# EAGLE design Impalyzer (EAGLE 7.6.0)
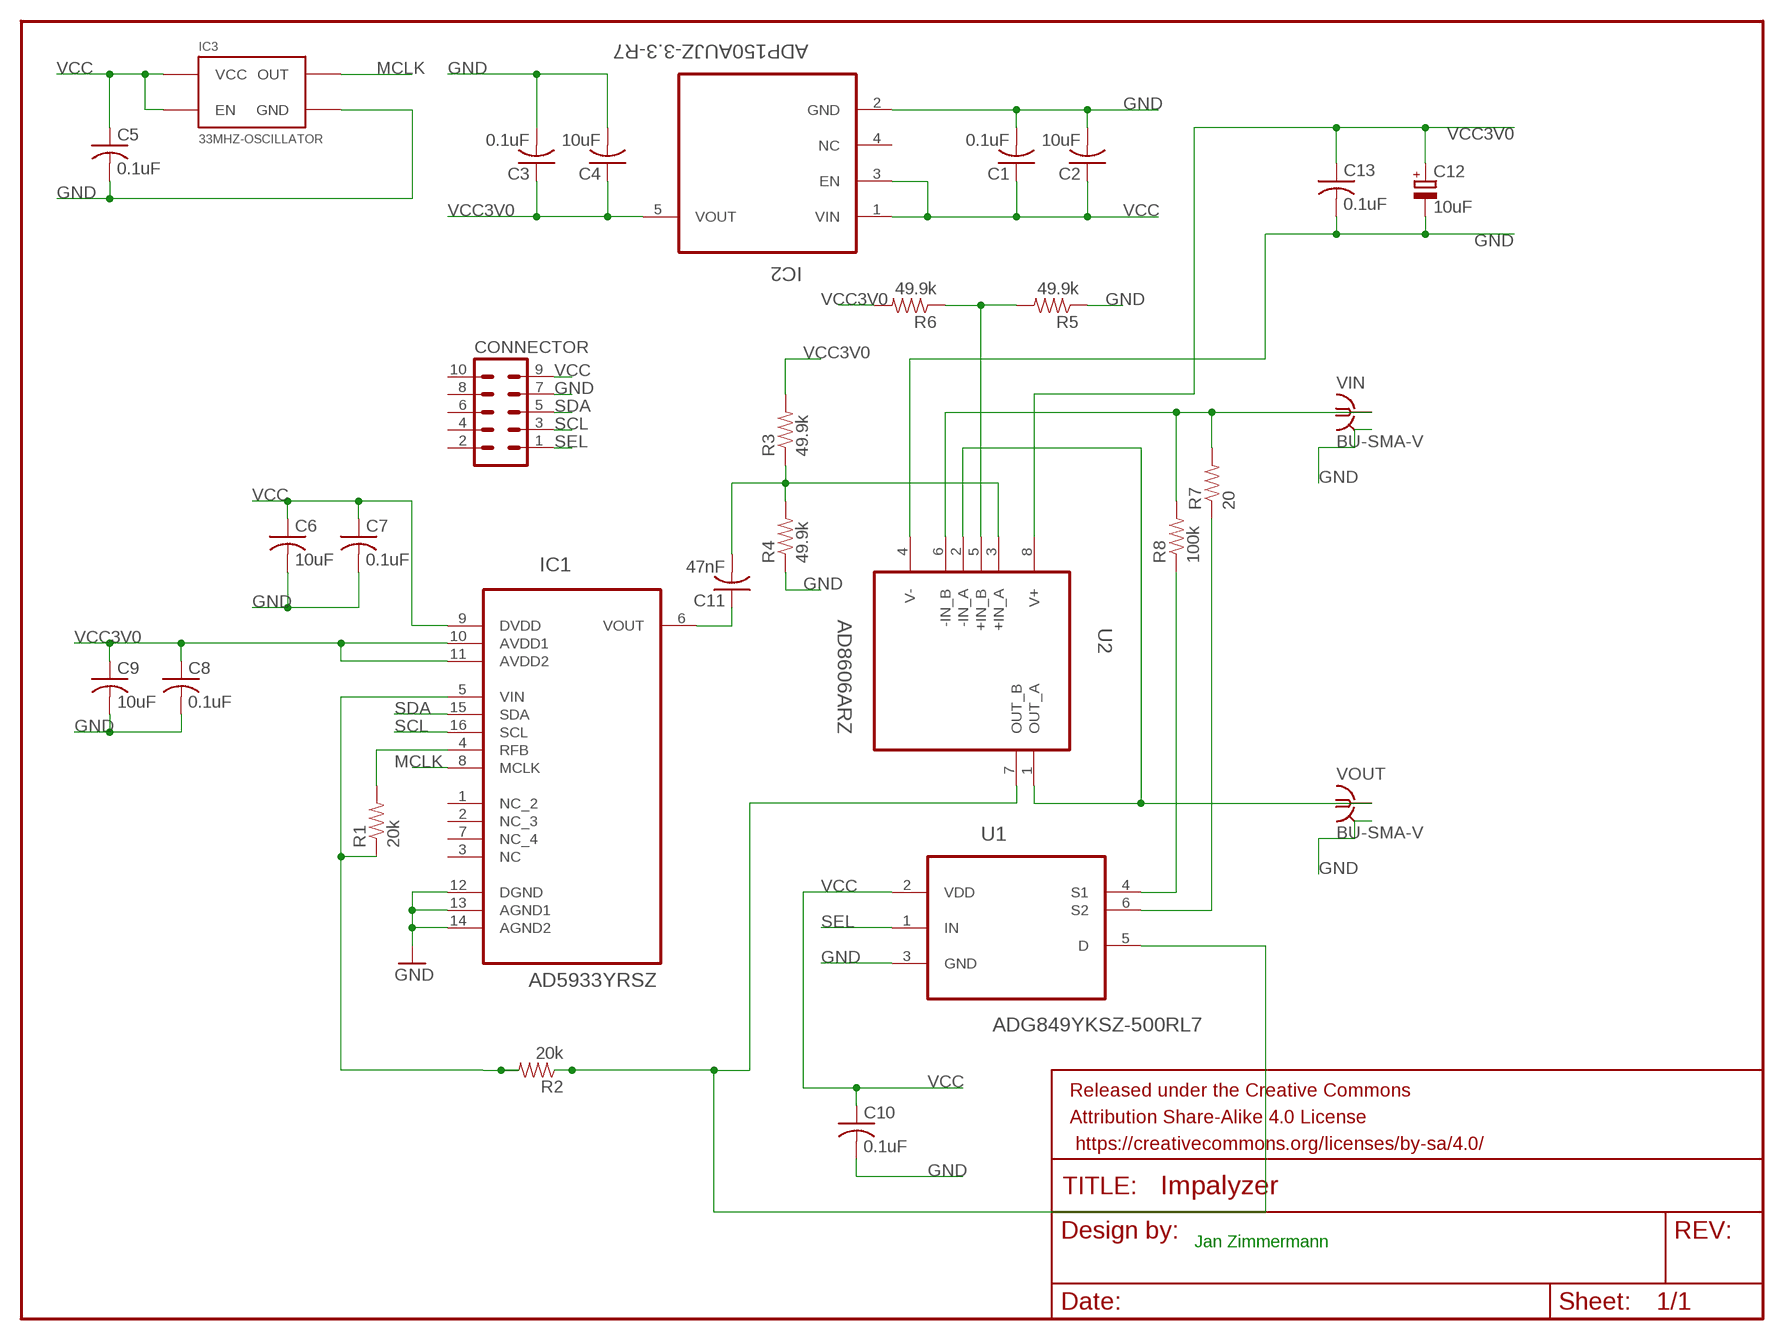
[diagram p0: schematic, sheet 1]

## Parts
C1  0.1uF  C-USC0402  [C0402]
C2  10uF  C-USC0402  [C0402]
C3  0.1uF  C-USC0402  [C0402]
C4  10uF  C-USC0402  [C0402]
C5  0.1uF  C-USC0402  [C0402]
C6  10uF  C-USC0402  [C0402]
C7  0.1uF  C-USC0402  [C0402]
C8  0.1uF  C-USC0402  [C0402]
C9  10uF  C-USC0402  [C0402]
C10  0.1uF  C-USC0402  [C0402]
C11  47nF  C-USC0402  [C0402]
C12  10uF  CPOL-EUA/3216-18W  [A/3216-18W]
C13  0.1uF  C-USC0402  [C0402]
CONNECTOR  MA05-2  [MA05-2]
FRAME1  FRAME-LETTERNO_PACKAGE  [DUMMY]
IC1  AD5933YRSZ  [SOP65P640X120-16N]
IC2  ADP150AUJZ-3.3-R7  [SOT95P280X100-5N]
IC3  33MHZ-OSCILLATOR  [CRYSTAL-OSC-SMD-5X3.2]
R1  20k  RESISTOR0603  [0603-RES]
R2  20k  RESISTOR0603  [0603-RES]
R3  49.9k  RESISTOR0603  [0603-RES]
R4  49.9k  RESISTOR0603  [0603-RES]
R5  49.9k  RESISTOR0603  [0603-RES]
R6  49.9k  RESISTOR0603  [0603-RES]
R7  20  RESISTOR2010  [R2010]
R8  100k  RESISTOR0603  [0603-RES]
U1  ADG849YKSZ-500RL7  [SOT65P210X110-6N]
U2  AD8606ARZ  [SOIC127P600X175-8N]
VIN  BU-SMA-V  [BU-SMA-V]
VOUT  BU-SMA-V  [BU-SMA-V]

## Nets
GND: C1.2 C2.2 C3.2 C4.2 C5.2 C6.2 C7.2 C8.2 C9.2 C10.2 C12.- C13.2 CONNECTOR.7 IC1.12(DGND) IC1.13(AGND1) IC1.14(AGND2) IC2.2(GND) IC3.2(GND) R4.1 R5.1 U1.3(GND) U2.4(V-) VIN.2 VIN.3 VIN.4 VIN.5 VOUT.2 VOUT.3 VOUT.4 VOUT.5
MCLK: IC1.8(MCLK) IC3.3(OUT)
N$1: R2.1 U1.5(D) U2.7(OUT_B)
N$2: C11.1 IC1.6(VOUT)
N$3: IC1.4(RFB) R1.2
N$4: IC1.5(VIN) R1.1 R2.2
N$5: U2.1(OUT_A) U2.2(-IN_A) VOUT.1
N$6: R7.2 R8.2 U2.6(-IN_B) VIN.1
N$12: C11.2 R3.1 R4.2 U2.3(+IN_A)
N$13: R5.2 R6.1 U2.5(+IN_B)
N$14: R8.1 U1.4(S1)
N$15: R7.1 U1.6(S2)
SCL: CONNECTOR.3 IC1.16(SCL)
SDA: CONNECTOR.5 IC1.15(SDA)
SEL: CONNECTOR.1 U1.1(IN)
VCC: C1.1 C2.1 C5.1 C6.1 C7.1 C10.1 CONNECTOR.9 IC1.9(DVDD) IC2.1(VIN) IC2.3(EN) IC3.1(EN) IC3.4(VCC) U1.2(VDD)
VCC3V0: C3.1 C4.1 C8.1 C9.1 C12.+ C13.1 IC1.10(AVDD1) IC1.11(AVDD2) IC2.5(VOUT) R3.2 R6.2 U2.8(V+)
Unconnected: CONNECTOR.2 CONNECTOR.4 CONNECTOR.6 CONNECTOR.8 CONNECTOR.10 IC1.1(NC_2) IC1.2(NC_3) IC1.3(NC) IC1.7(NC_4) IC2.4(NC)

## Notes on the sheet
- Jan Zimmermann

## Library data of the parts
C1-C11 C13 = rcl:C-US: CAPACITOR, American symbol
C12 = rcl:CPOL-EU: POLARIZED CAPACITOR, European symbol
CONNECTOR = con-lstb:MA05-2: PIN HEADER; OC_FARNELL: unknown; OC_NEWARK: unknown
FRAME1 = SparkFun-Aesthetics:FRAME-LETTER: Schematic Frame Standard 8.5x11 US Letter frame; DESIGNER: Nobody; VERSION: v01
IC1 = Analog Devices_By_element14_Batch_1:AD5933YRSZ: 1 MSPS, 12-Bit Impedance Converter, Network Analyzer; MPN: AD5933YRSZ; OC_FARNELL: 1438950; OC_NEWARK: 06M5088; PACKAGE: TSSOP-16; SUPPLIER: Analog Devices
IC2 = Analog Devices_By_element14_Batch_1:ADP150AUJZ-3.3-R7: Ultralow Noise, 150 mA CMOS Linear Regulator; MPN: ADP150AUJZ-3.3-R7; OC_FARNELL: 1786853; OC_NEWARK: 60R3276; PACKAGE: TSOT-5; SUPPLIER: Analog Devices
IC3 = SparkFun-FreqCtrl:33MHZ-OSCILLATOR: Generic 5x3.2 Oscillator; PROD_ID: XTAL-11986
R1-R8 = SparkFun-Resistors:RESISTOR: Resistor Basic schematic elements and footprints for 0603, 1206, and PTH resistors.
U1 = Analog Devices_By_element14_Batch_1:ADG849YKSZ-500RL7: SPDT/2:1 Mux; MPN: ADG849YKSZ-500RL7; OC_FARNELL: 1651265; OC_NEWARK: 19M8675; PACKAGE: SC-70-6; SUPPLIER: Analog Devices
U2 = Analog Devices_By_element14_Batch_1:AD8606ARZ: Precision, Low Noise, CMOS, Rail-to-Rail, Input/Output Operational Amplifiers; MPN: AD8606ARZ; OC_FARNELL: 9994343; OC_NEWARK: 19M0974; PACKAGE: SOIC-8; SUPPLIER: Analog Devices
VIN VOUT = con-coax:BU-SMA-V: FEMALE SMA CONNECTOR Radiall distributor RS 112-3794; OC_FARNELL: unknown; OC_NEWARK: unknown

## Board
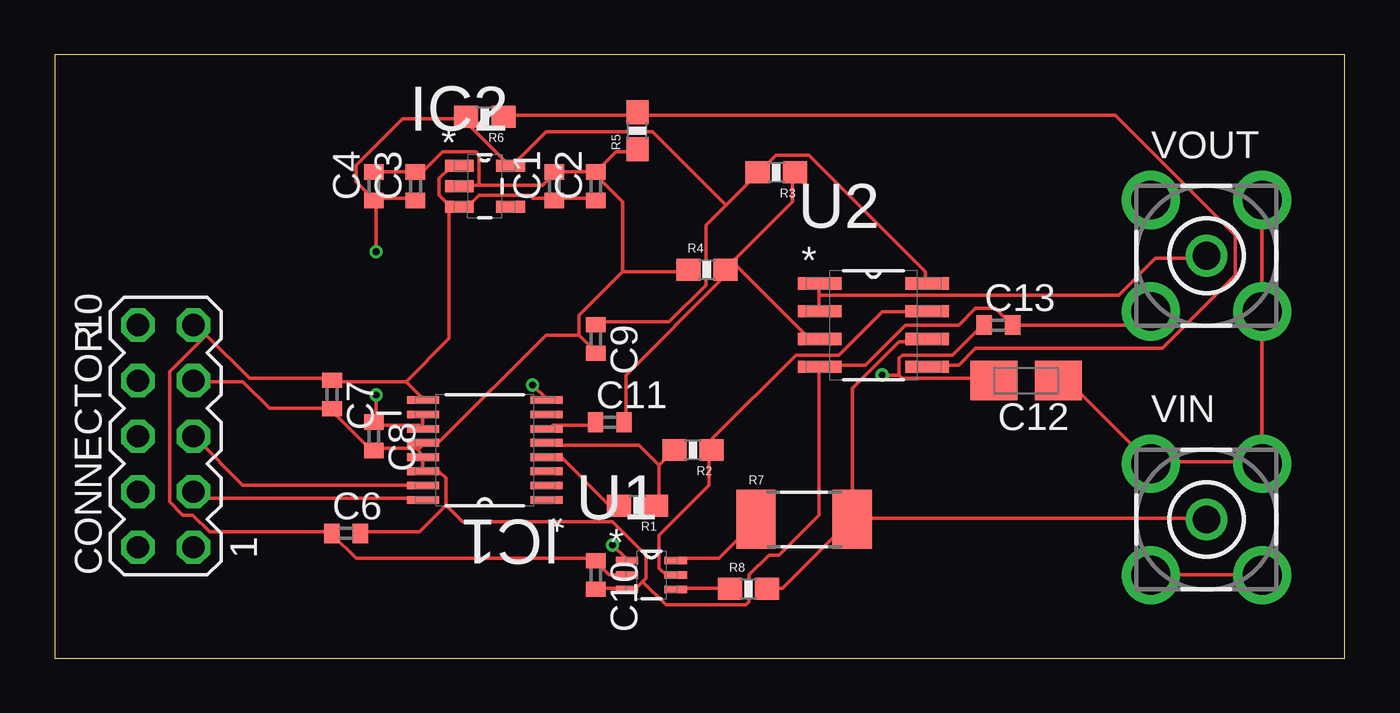
[diagram p1: board, top side]
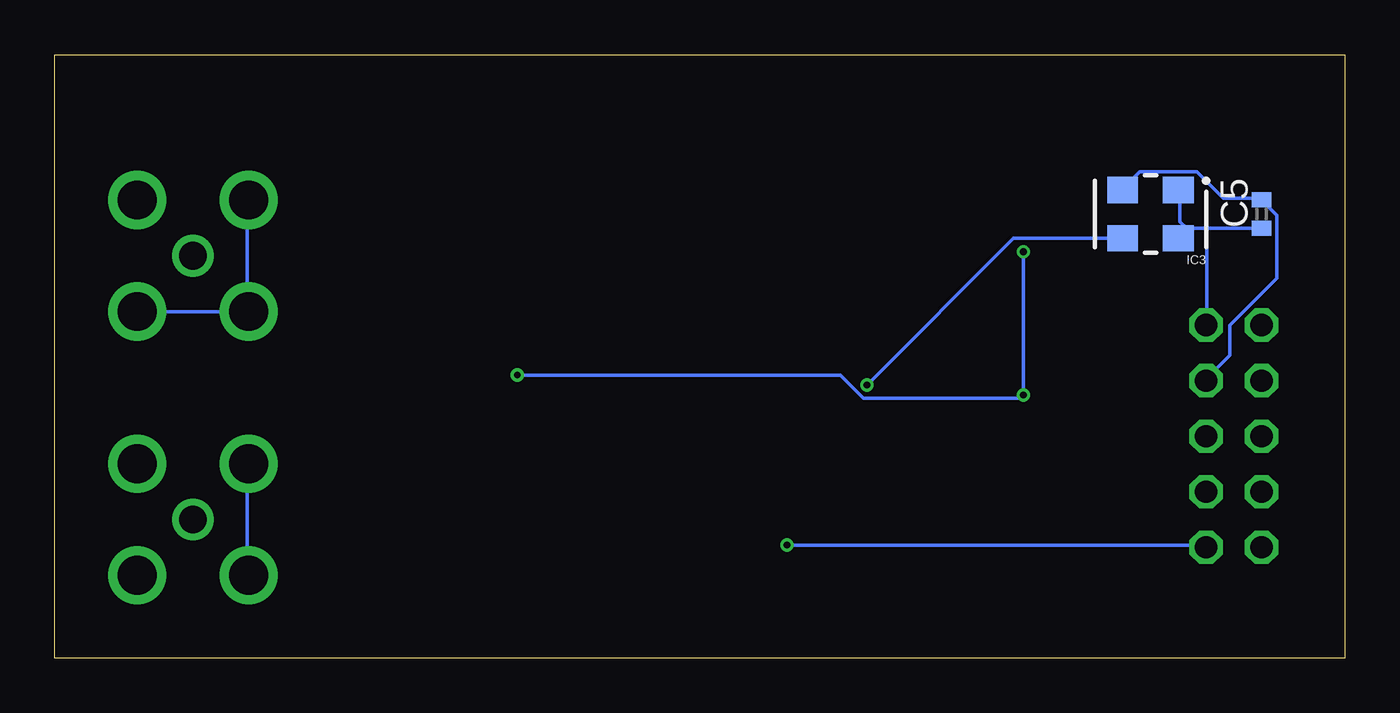
[diagram p2: board, bottom side, seen from below]

Size 59.03 x 27.61 mm. Coordinates in mm from the lower left corner, seen from the top.
Outline: 0,0 59.03,0 59.03,27.61 0,27.61 0,0
Copper layers (1*16): Top 0.035mm / dielectric 1.5mm / Bottom 0.035mm
Design rules "SeeedStudio_2layer_DRU_no_angle_20140221": minimum track width 6mil, minimum drill 12mil, track to track 6mil, track to pad 6mil, pad to pad 6mil, via to via 6mil, smd to smd 0mil, copper to edge 10mil, drill to drill 10mil, minimum pad ring 10mil, minimum via ring 6mil, stop-mask expansion 2mil, vias tented up to drill 100mil, thermal gap 10mil

### Footprints (pad centres in the part's own frame; a part is rotated, then mirrored left to right if it is on the bottom)
C0402 = smd 0.7 x 0.9: 1 -0.65,0; 2 0.65,0
A/3216-18W = smd 2.15 x 1.8: + 1.475,0; - -1.475,0
MA05-2 = drill 1.016 octagon: 1 -5.08,-1.27; 2 -5.08,1.27; 3 -2.54,-1.27; 4 -2.54,1.27; 5 0,-1.27; 6 0,1.27; 7 2.54,-1.27; 8 2.54,1.27; 9 5.08,-1.27; 10 5.08,1.27
SOP65P640X120-16N = smd 1.473 x 0.356: 1 -2.819,2.286; 2 -2.819,1.626; 3 -2.819,0.965; 4 -2.819,0.33; 5 -2.819,-0.33; 6 -2.819,-0.965; 7 -2.819,-1.626; 8 -2.819,-2.286; 9 2.819,-2.286; 10 2.819,-1.626; 11 2.819,-0.965; 12 2.819,-0.33; 13 2.819,0.33; 14 2.819,0.965; 15 2.819,1.626; 16 2.819,2.286
SOT95P280X100-5N = smd 1.321 x 0.559: 1 -1.168,0.94; 2 -1.168,0; 3 -1.168,-0.94; 4 1.168,-0.94; 5 1.168,0.94
CRYSTAL-OSC-SMD-5X3.2 = smd 1.397 x 1.194: 1 -1.27,-1.1; 2 1.27,-1.1; 3 1.27,1.1; 4 -1.27,1.1
0603-RES = smd 1.1 x 1: 1 -0.85,0; 2 0.85,0
R2010 = smd 1.8 x 2.7: 1 -2.2,0; 2 2.2,0
SOT65P210X110-6N = smd 1.016 x 0.356: 1 -1.118,0.66; 2 -1.118,0; 3 -1.118,-0.66; 4 1.118,-0.66; 5 1.118,0; 6 1.118,0.66
SOIC127P600X175-8N = smd 1.981 x 0.559: 1 -2.464,1.905; 2 -2.464,0.635; 3 -2.464,-0.635; 4 -2.464,-1.905; 5 2.464,-1.905; 6 2.464,-0.635; 7 2.464,0.635; 8 2.464,1.905
BU-SMA-V = drill 1.27: 1 0,0 | drill 1.778: 2 -2.55,2.55; 3 2.55,2.55; 4 2.55,-2.55; 5 -2.55,-2.55

### Placement (x,y rotation side)
C1  22.86,21.59 90 top
C2  24.77,21.59 90 top
C3  16.51,21.59 90 top
C4  14.61,21.59 90 top
C5  3.81,20.32 90 bottom
C6  13.34,5.71 0 top
C7  12.7,12.06 270 top
C8  14.61,10.16 270 top
C9  24.77,14.61 270 top
C10  24.77,3.81 270 top
C11  25.4,10.79 0 top
C12  44.45,12.7 180 top
C13  43.18,15.24 0 top
CONNECTOR  5.08,10.16 90 top
FRAME1  11.43,51.44 0 top  (outside the outline)
IC1  19.68,9.53 180 top
IC2  19.68,21.59 0 top
IC3  8.89,20.32 180 bottom
R1  26.67,6.99 180 top
R2  29.21,9.53 180 top
R3  33.02,22.23 180 top
R4  29.84,17.78 0 top
R5  26.67,24.13 90 top
R6  19.68,24.77 180 top
R7  34.29,6.35 0 top
R8  31.75,3.17 0 top
U1  27.3,3.81 0 top
U2  37.46,15.24 0 top
VIN  52.7,6.35 0 top
VOUT  52.7,18.41 0 top

### Tracks (layer width: path | path; a pad name or v marks a point on that pad's centre or on a via)
GND
  Top 0.152: 24,14.78 24.77,14.02 C9.2 | 24,14.78 24,15.7 25.98,17.68 | 25.98,17.68 28.88,17.68 R4.1 | C4.2 14.71,22.25 16.38,22.25 C3.2 16.54,22.25 16.84,22.25 17.75,23.16 19.28,23.16 19.43,23.01 19.43,21.64 | C2.2 22.94,22.25 C1.2 22.78,22.1 22.33,21.64 19.43,21.64 | C2.2 25.68,23.16 26.59,23.16 R5.1 | C2.2 24.77,22.1 25.98,20.88 25.98,17.68 | 19.43,21.64 18.52,21.64 IC2.2 | C10.2 24.77,3.2 26.14,3.2 U1.3 26.29,3.2 26.59,3.2 26.9,3.5 | 17.91,7.01 16.69,5.79 14.1,5.79 C6.2 | 17.91,7.01 17.91,8.23 17.6,8.53 16.99,8.53 IC1.14 16.84,8.69 16.84,9.14 IC1.13 16.84,9.3 16.54,9.6 | 26.9,3.5 27.05,3.66 27.05,4.72 25.53,6.25 18.67,6.25 17.91,7.01 | 16.54,9.6 16.69,9.6 16.84,9.75 IC1.12 16.99,9.91 17.6,9.91 22.48,14.78 24,14.78 | 16.54,9.6 14.71,9.6 C8.2 14.55,9.45 12.73,11.28 C7.2 12.57,11.43 9.83,11.43 8.61,12.65 6.48,12.65 CONNECTOR.7 | VIN.5 50.22,3.81 VIN.4 | C12.- 45.95,12.65 46.41,12.65 VIN.2 50.22,8.99 55.24,8.99 | VOUT.3 55.24,20.88 55.24,16 VOUT.4 55.24,15.85 55.24,8.99 | VOUT.5 50.06,15.85 49.45,15.24 C13.2 43.05,16 42.14,16 41.38,15.24 38.94,15.24 37.11,13.41 35.13,13.41 U2.4 34.98,13.26 34.98,6.55 33.15,4.72 32.69,4.72 31.77,3.81 31.77,2.59 31.62,2.44 27.96,2.44 26.9,3.5 | 55.24,8.99 VIN.3
  Bottom 0.152: IC3.2 10.13,21.49 9.37,22.25 6.78,22.25 5.56,21.03 3.89,21.03 C5.2 3.73,20.88 3.12,20.27 3.12,17.37 5.26,15.24 5.26,13.87 6.33,12.8 CONNECTOR.7 | VIN.5 50.22,3.81 50.22,8.84 VIN.2 | VOUT.2 50.22,20.88 50.22,16 VOUT.5 50.22,15.85 55.24,15.85 VOUT.4
MCLK  (via drill 0.3)
  Top 0.152: v21.87,12.5 22.48,11.89 IC1.8
  Bottom 0.152: v21.87,12.5 15.16,19.2 10.29,19.2 IC3.3
N$1
  Top 0.152: U1.5 27.96,3.81 27.66,4.12 27.66,5.64 29.95,7.92 29.95,9.45 R2.1 30.1,9.6 30.1,10.06 33.91,13.87 35.89,13.87 37.87,15.85 39.85,15.85 U2.7
N$2
  Top 0.152: C11.1 24.61,10.67 22.78,10.67 22.63,10.52 IC1.6
N$3
  Top 0.152: R1.2 25.68,7.01 25.38,7.01 23.24,9.14 22.63,9.14 IC1.4
N$4
  Top 0.152: 27.66,8.84 27.66,7.01 R1.1 | 27.66,8.84 28.27,9.45 R2.2 | 27.66,8.84 26.75,9.75 22.63,9.75 IC1.5
N$5
  Top 0.152: 34.98,16.61 34.98,17.07 U2.1 | 34.98,16.61 34.98,16 U2.2 | 34.98,16.61 48.69,16.61 50.37,18.29 52.65,18.29 VOUT.1
N$6
  Top 0.152: R8.2 32.69,3.2 33.3,3.2 36.35,6.25 R7.2 36.5,6.4 | 36.5,6.4 36.5,12.34 38.63,14.48 39.85,14.48 U2.6 | 36.5,6.4 52.65,6.4 VIN.1
N$12
  Top 0.152: C11.2 26.14,10.82 26.14,12.95 30.56,17.37 30.56,17.68 R4.2 | 31.01,18.14 30.71,17.83 R4.2 | 31.01,18.14 33.76,20.88 33.76,22.1 R3.1 | 31.01,18.14 34.52,14.63 34.98,14.63 U2.3 | 31.01,18.14 R4.2
N$13
  Top 0.152: R6.1 20.65,24.84 26.59,24.84 R5.2 26.75,24.84 48.54,24.84 54.03,19.36 54.03,17.53 50.67,14.17 42.14,14.17 41.38,13.41 40,13.41 U2.5
N$14
  Top 0.152: U1.4 28.42,3.2 30.86,3.2 R8.1
N$15
  Top 0.152: U1.6 28.42,4.57 30.4,4.57 32.08,6.25 R7.1
SCL
  Top 0.152: IC1.16 16.84,7.32 6.78,7.32 6.48,7.62 CONNECTOR.3
SDA
  Top 0.152: IC1.15 16.84,7.92 8.61,7.92 6.48,10.06 CONNECTOR.5
SEL  (via drill 0.3)
  Top 0.152: v25.53,5.18 26.14,4.57 U1.1
  Bottom 0.152: v25.53,5.18 6.48,5.18 CONNECTOR.1
VCC
  Top 0.152: U1.2 25.38,3.81 24.77,4.42 C10.1 24.77,4.57 13.79,4.57 12.73,5.64 C6.1 12.57,5.79 7.09,5.79 6.33,6.55 5.87,6.55 5.26,7.16 5.26,13.11 6.93,14.78 | C2.1 24.77,21.03 22.94,21.03 C1.1 22.78,21.03 21.87,21.03 21.72,21.18 19.43,21.18 18.97,20.73 18.52,20.73 | 18.06,20.73 18.52,20.73 | 18.06,20.73 17.6,21.18 17.6,21.95 18.06,22.4 18.52,22.4 IC2.1 | 18.52,20.73 IC2.3 18.06,20.73 | 16.08,12.65 12.73,12.65 C7.1 12.57,12.8 8.92,12.8 6.93,14.78 | 16.08,12.65 16.84,11.89 IC1.9 | 6.93,14.78 6.48,15.24 CONNECTOR.9 6.93,14.78 | 18.06,20.73 18.06,14.63 16.08,12.65
  Bottom 0.152: 7.24,19.66 6.33,19.66 | 6.33,19.66 3.89,19.66 C5.1 | 7.24,19.66 7.54,19.36 IC3.4 7.24,19.66 | 7.24,19.66 7.54,19.96 7.54,21.34 IC3.1 | 6.33,19.66 6.33,15.24 CONNECTOR.9
VCC3V0  (via drill 0.3)
  Top 0.152: 30.71,20.73 32.08,22.1 R3.2 32.23,22.25 32.99,23.01 34.52,23.01 39.85,17.68 39.85,17.22 U2.8 | 30.71,20.73 29.79,19.81 29.79,17.07 28.12,15.39 24.77,15.39 C9.1 | 38.63,12.95 38.63,13.72 38.79,13.87 41.07,13.87 42.44,15.24 C13.1 | 38.63,12.95 38.79,12.8 42.9,12.8 C12.+ | 16.84,10.52 16.69,10.67 14.71,10.67 C8.1 14.71,10.82 v14.71,12.04 | 16.84,10.52 16.84,11.12 IC1.10 | 16.84,10.52 IC1.11 | C4.1 14.71,21.03 16.38,21.03 C3.1 | C4.1 14.55,21.03 13.79,21.79 13.79,22.55 15.93,24.69 18.82,24.69 R6.2 18.97,24.69 18.97,24.38 20.8,22.55 IC2.5 20.95,22.55 22.48,24.08 27.36,24.08 30.71,20.73 | v14.71,18.59 14.71,20.88 C4.1 | v37.87,12.95 38.63,12.95
  Bottom 0.152: v14.71,18.59 v14.71,12.04 14.86,11.89 22.02,11.89 23.09,12.95 v37.87,12.95